# EAGLE design card_template (EAGLE 9.6.2)
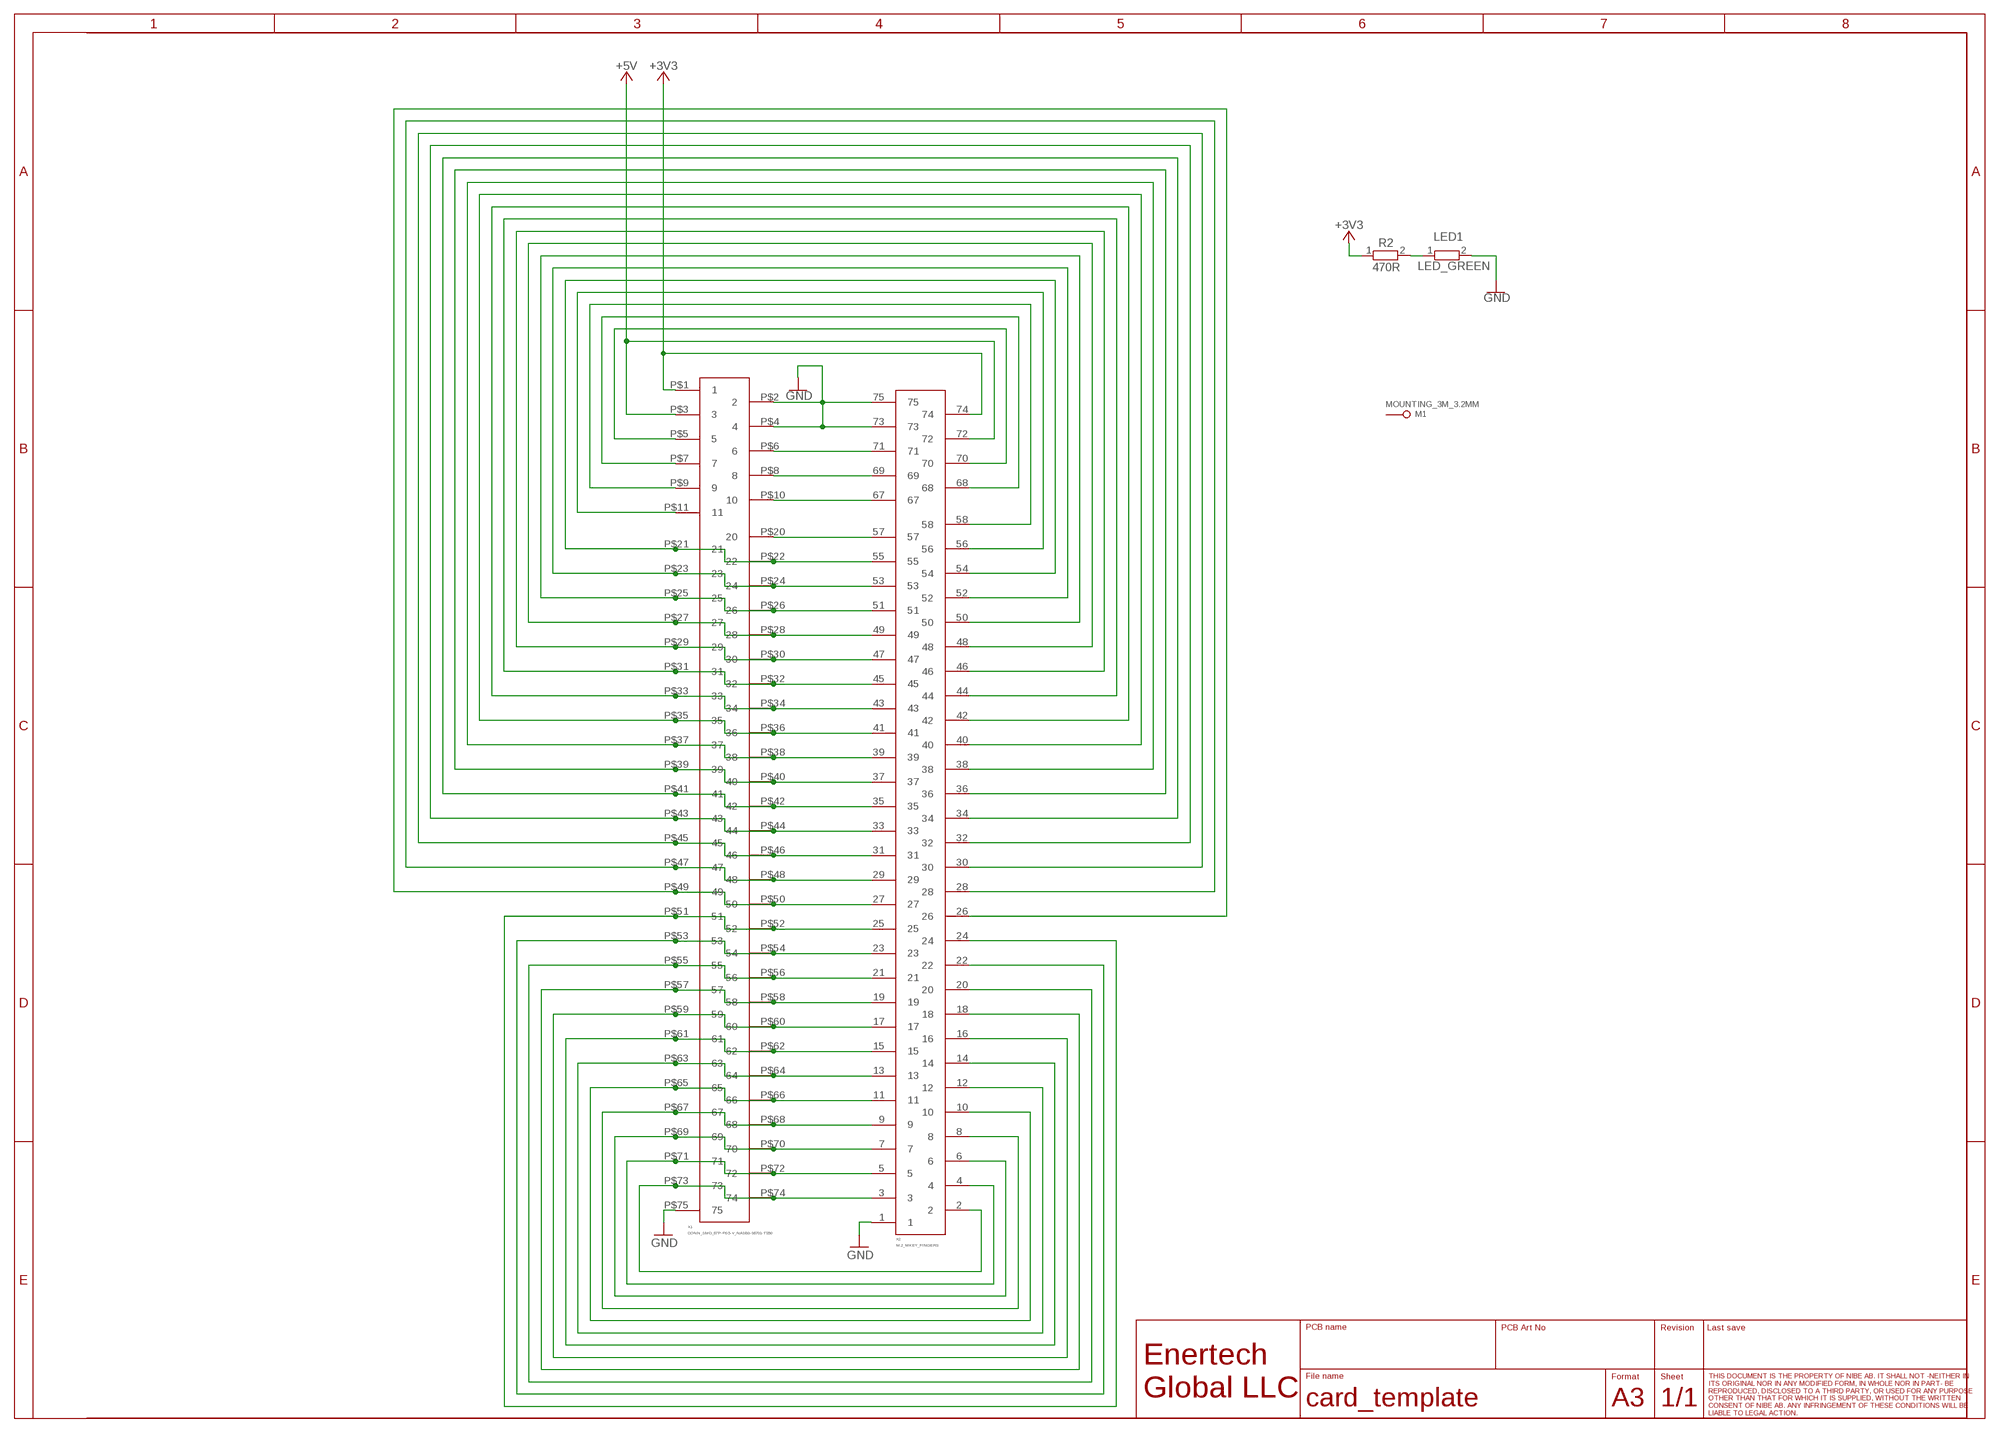
[diagram p0: schematic, sheet 1]

## Parts
LED1  LED_GREEN  R-EU_R0603  [R0603]
M1  MOUNTING_3M_3.2MM  [MOUNTING_3M_3.2MM]
R2  470R  R-EU_R0603  [R0603]
X1  CONN_SMD_67P-P0.5-V_NASB0-S6701-TS50  [CONN_SMD_67P-P0.5-V_NASB0-S6701-TS50]
X2  M.2_MKEY_FINGERS  [M.2_MKEY_FINGERS]

## Nets
+3V3: R2.1 X1.P$1 X2.74
+5V: X1.P$3 X2.72
GND: LED1.2 X1.P$2 X1.P$4 X1.P$75 X2.1 X2.73 X2.75
N$1: X1.P$23 X1.P$24 X2.52 X2.53
N$2: X1.P$25 X1.P$26 X2.50 X2.51
N$3: X1.P$73 X1.P$74 X2.2 X2.3
N$4: X1.P$71 X1.P$72 X2.4 X2.5
N$5: X1.P$69 X1.P$70 X2.6 X2.7
N$6: X1.P$67 X1.P$68 X2.8 X2.9
N$7: X1.P$65 X1.P$66 X2.10 X2.11
N$8: X1.P$63 X1.P$64 X2.12 X2.13
N$9: X1.P$61 X1.P$62 X2.14 X2.15
N$10: X1.P$59 X1.P$60 X2.16 X2.17
N$11: X1.P$57 X1.P$58 X2.18 X2.19
N$12: X1.P$55 X1.P$56 X2.20 X2.21
N$13: X1.P$53 X1.P$54 X2.22 X2.23
N$14: X1.P$51 X1.P$52 X2.24 X2.25
N$15: X1.P$21 X1.P$22 X2.54 X2.55
N$16: X1.P$27 X1.P$28 X2.48 X2.49
N$17: X1.P$29 X1.P$30 X2.46 X2.47
N$18: X1.P$31 X1.P$32 X2.44 X2.45
N$19: X1.P$33 X1.P$34 X2.42 X2.43
N$20: X1.P$35 X1.P$36 X2.40 X2.41
N$21: X1.P$37 X1.P$38 X2.38 X2.39
N$22: X1.P$39 X1.P$40 X2.36 X2.37
N$23: X1.P$41 X1.P$42 X2.34 X2.35
N$24: X1.P$43 X1.P$44 X2.32 X2.33
N$25: X1.P$45 X1.P$46 X2.30 X2.31
N$26: X1.P$47 X1.P$48 X2.28 X2.29
N$27: X1.P$49 X1.P$50 X2.26 X2.27
N$28: X1.P$11 X2.56
N$29: X1.P$9 X2.58
N$30: X1.P$7 X2.68
N$31: X1.P$5 X2.70
N$33: LED1.1 R2.2
N$36: X1.P$6 X2.71
N$37: X1.P$8 X2.69
N$38: X1.P$10 X2.67
N$39: X1.P$20 X2.57
Unconnected: M1.P$1 M1.P$2 M1.P$3

## Library data of the parts
LED1 R2 = _NIBE_rcl:R-EU_: RES THK 1% SMD
M1 = ENERTECH_MISC:MOUNTING_3M_3.2MM
X1 = ENERTECH_MISC:CONN_SMD_67P-P0.5-V_NASB0-S6701-TS50
X2 = ENERTECH_MISC:M.2_MKEY_FINGERS

## Board
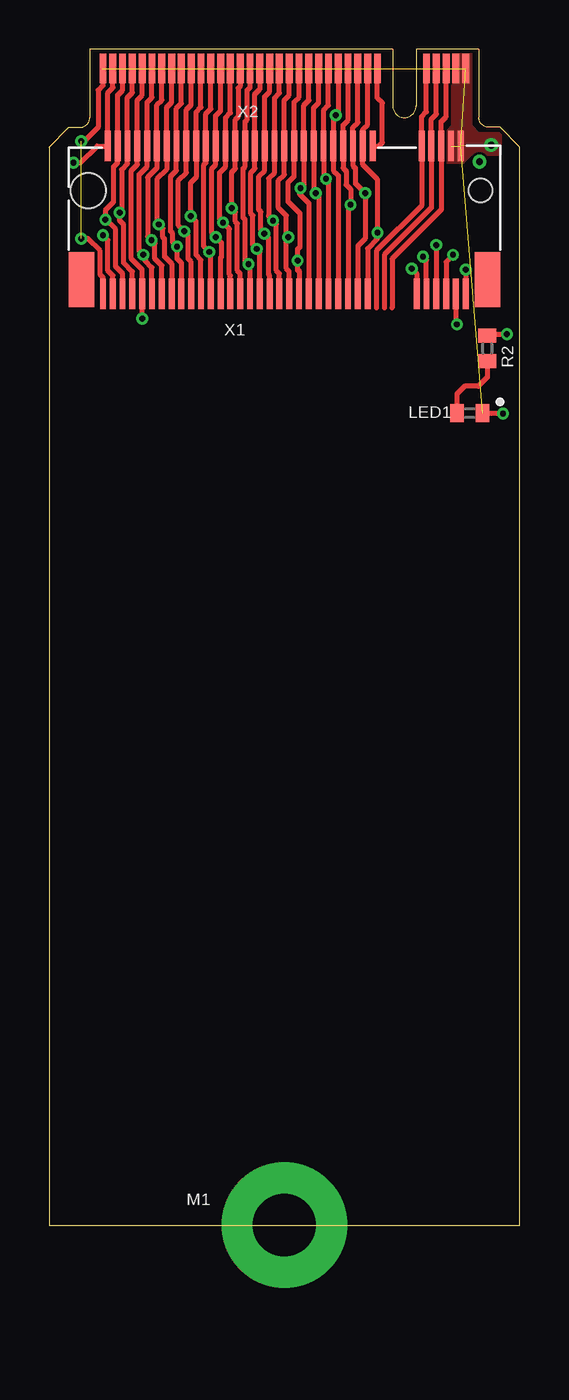
[diagram p1: board, top side]
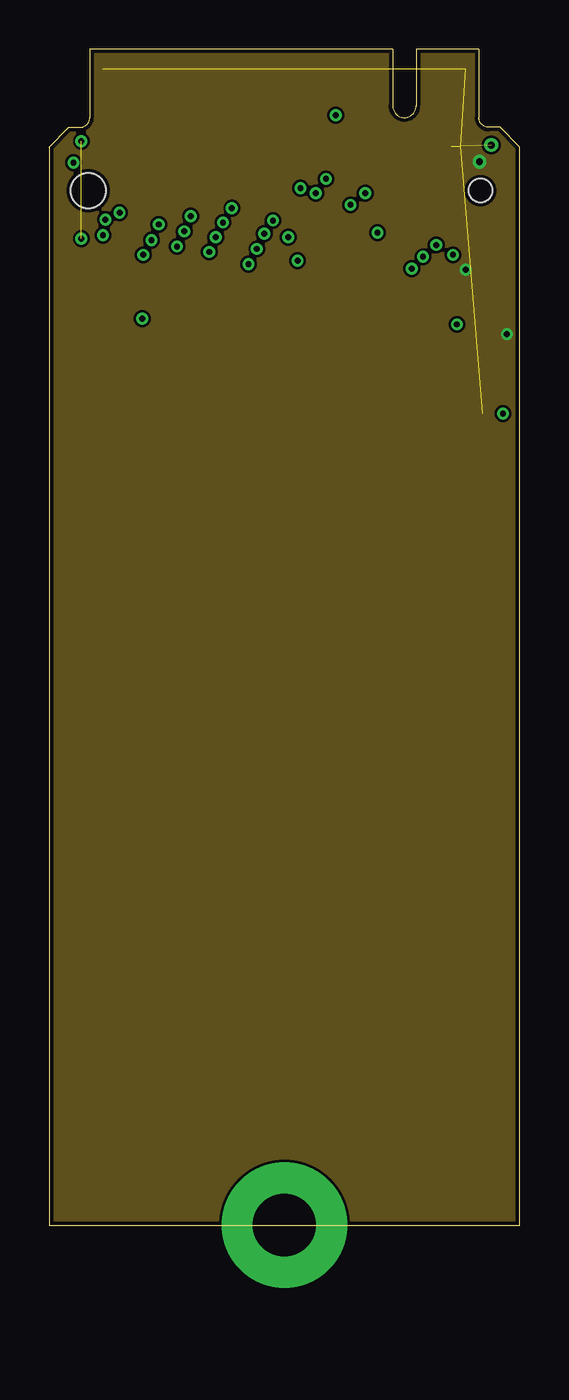
[diagram p2: board, inner layer +3v3]
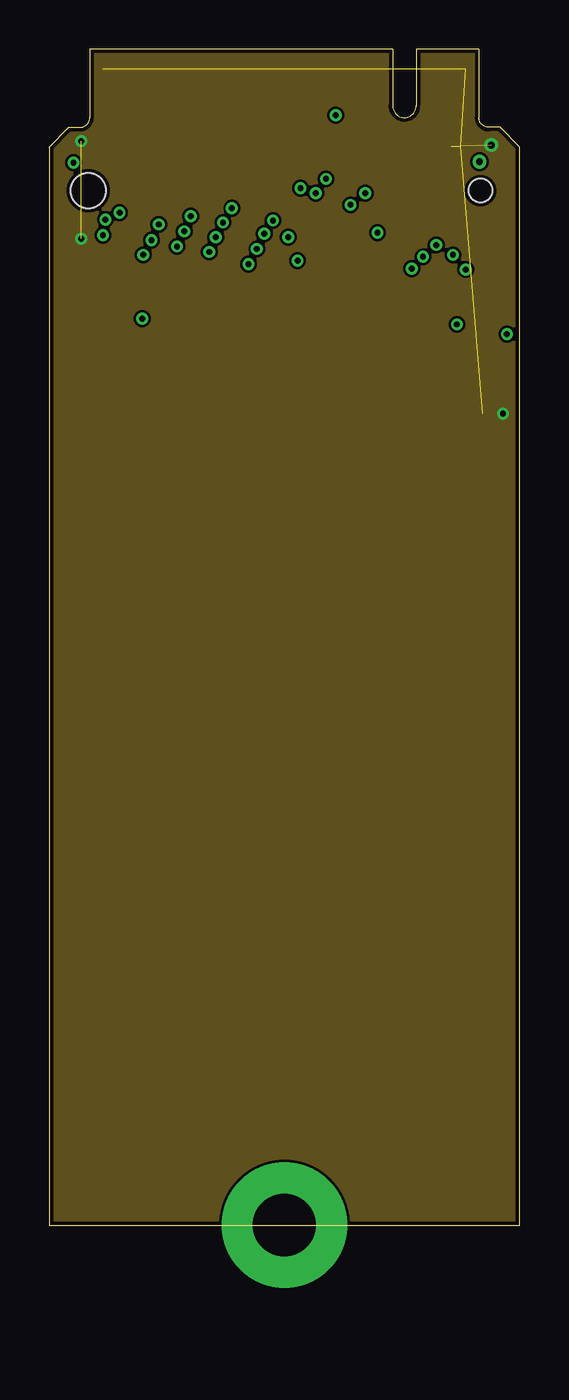
[diagram p3: board, inner layer GND]
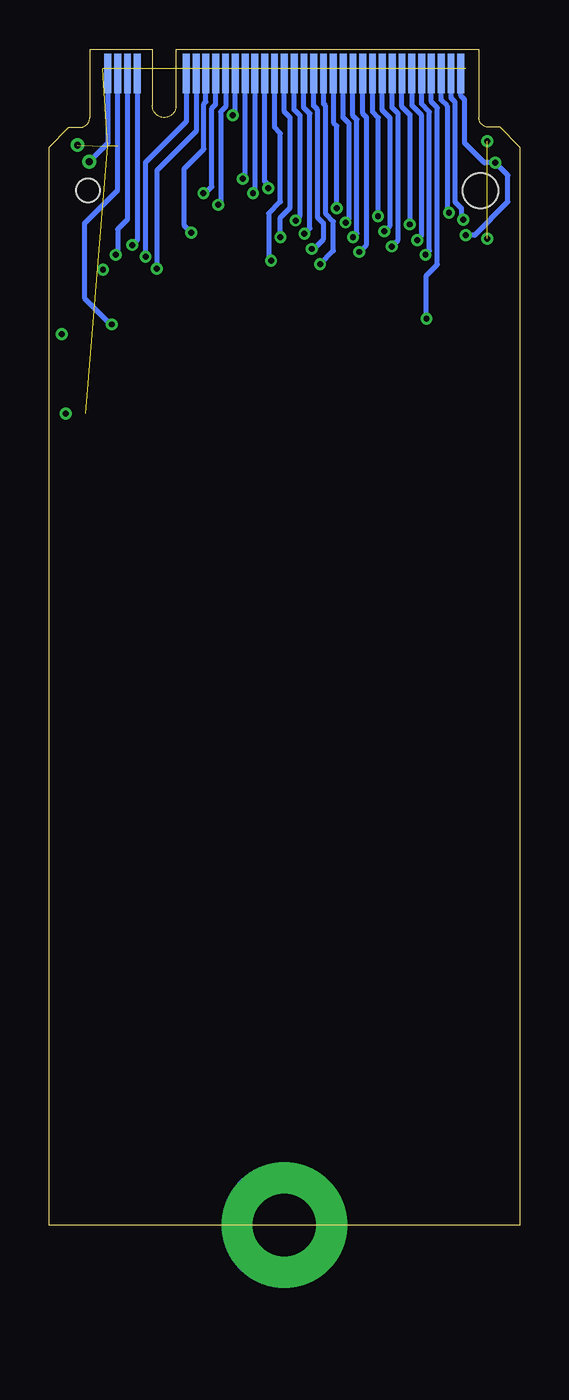
[diagram p4: board, bottom side, seen from below]

Size 24 x 60 mm. Coordinates in mm from the lower left corner, seen from the top.
Outline: 0,0 24,0 24,55 23,56 22.43,56 arc-90 21.93,56.5 21.93,60 18.73,60 18.73,57.1 arc-180 17.52,57.1 17.52,60 2.08,60 2.08,56.5 arc-90 1.57,56 1,56 0,55 0,0
Copper layers (1+2*15+16): Top 0.035mm / dielectric 0.1mm / +3v3 0.035mm / dielectric 1.24mm / GND 0.035mm / dielectric 0.1mm / Bottom 0.035mm
Design rules "enertech_chimera *": minimum track width 10mil, minimum drill 0.3mm, track to track 5mil, track to pad 5mil, pad to pad 5mil, via to via 5mil, smd to smd 0mil, copper to edge 0.2mm, drill to drill 0.5mm, minimum pad ring 0.15mm, minimum via ring 0.15mm, stop-mask expansion 1mil, vias tented up to drill 14mil, thermal gap 4mil

### Footprints (pad centres in the part's own frame; a part is rotated, then mirrored left to right if it is on the bottom)
R0603 = smd 0.7 x 0.9: 1 -0.65,0; 2 0.65,0
MOUNTING_3M_3.2MM = drill 3.2 pad 3.6: P$1 0,0 | smd 6.4 x 6.4: P$2 0,0 | smd 6.4 x 6.4 bottom: P$3 0,0
CONN_SMD_67P-P0.5-V_NASB0-S6701-TS50 = smd 0.3 x 1.55: P$1 -9.25,3.775; P$2 -9,-3.775; P$3 -8.75,3.775; P$4 -8.5,-3.775; P$5 -8.25,3.775; P$6 -8,-3.775; P$7 -7.75,3.775; P$8 -7.5,-3.775; P$9 -7.25,3.775; P$10 -7,-3.775; P$11 -6.75,3.775; P$20 -4.5,-3.775; P$21 -4.25,3.775; P$22 -4,-3.775; P$23 -3.75,3.775; P$24 -3.5,-3.775; P$25 -3.25,3.775; P$26 -3,-3.775; P$27 -2.75,3.775; P$28 -2.5,-3.775; P$29 -2.25,3.775; P$30 -2,-3.775; P$31 -1.75,3.775; P$32 -1.5,-3.775; P$33 -1.25,3.775; P$34 -1,-3.775; P$35 -0.75,3.775; P$36 -0.5,-3.775; P$37 -0.25,3.775; P$38 0,-3.775; P$39 0.25,3.775; P$40 0.5,-3.775; P$41 0.75,3.775; P$42 1,-3.775; P$43 1.25,3.775; P$44 1.5,-3.775; P$45 1.75,3.775; P$46 2,-3.775; P$47 2.25,3.775; P$48 2.5,-3.775; P$49 2.75,3.775; P$50 3,-3.775; P$51 3.25,3.775; P$52 3.5,-3.775; P$53 3.75,3.775; P$54 4,-3.775; P$55 4.25,3.775; P$56 4.5,-3.775; P$57 4.75,3.775; P$58 5,-3.775; P$59 5.25,3.775; P$60 5.5,-3.775; P$61 5.75,3.775; P$62 6,-3.775; P$63 6.25,3.775; P$64 6.5,-3.775; P$65 6.75,3.775; P$66 7,-3.775; P$67 7.25,3.775; P$68 7.5,-3.775; P$69 7.75,3.775; P$70 8,-3.775; P$71 8.25,3.775; P$72 8.5,-3.775; P$73 8.75,3.775; P$74 9,-3.775; P$75 9.25,3.775 | smd 1.3 x 2.8: P$76 10.35,3.05; P$77 -10.35,3.05 | hole 1.2: -10,-1.5 | hole 1.8: 10,-1.5
M.2_MKEY_FINGERS = smd 0.35 x 1.5: 1 -9.25,-1; 3 -8.75,-1; 5 -8.25,-1; 7 -7.75,-1; 9 -7.25,-1; 11 -6.75,-1; 13 -6.25,-1; 15 -5.75,-1; 17 -5.25,-1; 19 -4.75,-1; 21 -4.25,-1; 23 -3.75,-1; 25 -3.25,-1; 27 -2.75,-1; 29 -2.25,-1; 31 -1.75,-1; 33 -1.25,-1; 35 -0.75,-1; 37 -0.25,-1; 39 0.25,-1; 41 0.75,-1; 43 1.25,-1; 45 1.75,-1; 47 2.25,-1; 49 2.75,-1; 51 3.25,-1; 53 3.75,-1; 55 4.25,-1; 57 4.75,-1; 67 7.25,-1; 69 7.75,-1; 71 8.25,-1; 73 8.75,-1; 75 9.25,-1 | smd 0.35 x 2 bottom: 2 -9,-1.25; 4 -8.5,-1.25; 6 -8,-1.25; 8 -7.5,-1.25; 10 -7,-1.25; 12 -6.5,-1.25; 14 -6,-1.25; 16 -5.5,-1.25; 18 -5,-1.25; 20 -4.5,-1.25; 22 -4,-1.25; 24 -3.5,-1.25; 26 -3,-1.25; 28 -2.5,-1.25; 30 -2,-1.25; 32 -1.5,-1.25; 34 -1,-1.25; 36 -0.5,-1.25; 38 0,-1.25; 40 0.5,-1.25; 42 1,-1.25; 44 1.5,-1.25; 46 2,-1.25; 48 2.5,-1.25; 50 3,-1.25; 52 3.5,-1.25; 54 4,-1.25; 56 4.5,-1.25; 58 5,-1.25; 68 7.5,-1.25; 70 8,-1.25; 72 8.5,-1.25; 74 9,-1.25

### Placement (x,y rotation side)
LED1  21.45,41.42 0 top
M1  12,0 0 top
R2  22.35,44.73 270 top
X1  12,51.27 180 top
X2  12,60 0 top

### Tracks (layer width: path | path; a pad name or v marks a point on that pad's centre or on a via)
+3V3  (via drill 0.3, 0.35)
  Top 0.254: v21.25,48.75 X1.P$1 | R2.1 22.43,45.45 v23.35,45.45
  Bottom 0.254: X2.74 21,55.2 v21.95,54.25
  pour +3v3 (no thermals): -1,0 -1,61 25,61 25,-1 -1,-1
+5V  (via drill 0.3)
  Top 0.254: X1.P$3 20.75,46 v20.8,45.95
  Bottom 0.254: v20.8,45.95 20.85,45.95 22.2,47.3 22.2,51.1 20.5,52.8 X2.72
GND  (via drill 0.3, 0.35)  (7 unrouted)
  Top 0.254: v23.15,41.4 22.12,41.4 LED1.2 | X2.1 2.75,58.15 2.5,57.9 2.5,56 1.8,55.3 v1.65,55.3 | X1.P$75 2.75,48.35 2.6,48.5 2.6,49.7 1.98,50.33 v1.65,50.33
  other vias: 22.55,55.1
  pour GND (no thermals): -1,-1 -1,61 25,61 25,-1
  pour Top (no thermals): 20.3,54.2 20.3,55.8 20.6,56.1 20.6,59.8 21.5,59.8 21.5,56.1 21.9,55.7 23,55.7 23,54.6 21.5,54.6 21.1,54.2
N$1  (via drill 0.3)
  Top 0.254: X2.53 15.75,56.25 15.5,56 X1.P$24 15.5,54.05 15.62,53.92 15.62,53.15 v16.12,52.65 16.12,50.33 15.75,49.95 X1.P$23
  Bottom 0.254: X2.52 15.5,57.17 15.7,56.98 15.7,52.98 16.02,52.65 v16.12,52.65
N$2  (via drill 0.3)
  Top 0.254: X2.51 15.25,56.38 15,56.12 X1.P$26 15,53.92 15.15,53.77 15.15,53.08 15.38,52.85 v15.38,52.05 15.25,51.92 X1.P$25
  Bottom 0.254: X2.50 15,57.05 15.25,56.8 15.25,52.17 v15.38,52.05
N$3  (via drill 0.3)
  Top 0.254: X2.3 3.25,58.02 3,57.77 X1.P$74 2.45,55.05 1.6,54.2 v1.25,54.2 | v2.75,50.5 | X1.P$73 3.25,48.45 3,48.7 3,50.25 v2.75,50.5
  Bottom 0.254: v2.75,50.5 2.3,50.5 0.6,52.2 0.6,53.55 v1.25,54.2 1.8,54.2 2.8,55.2 2.8,57.42 3,57.62 X2.2
N$4  (via drill 0.3)
  Top 0.254: X2.5 3.75,57.9 3.5,57.65 X1.P$72 3.5,54.2 3.3,54 3.3,52.2 2.88,51.77 v2.88,51.3 2.9,51.3 3.4,50.8 3.4,48.9 3.75,48.55 X1.P$71
  Bottom 0.254: v2.88,51.3 2.98,51.4 2.98,51.88 3.3,52.2 3.3,57.3 3.5,57.5 X2.4
N$5  (via drill 0.3)
  Top 0.254: X2.7 4.25,57.77 4,57.52 X1.P$70 4,54.15 3.7,53.85 3.7,51.75 v3.6,51.65 3.6,51.25 3.8,51.05 3.8,49.1 4.25,48.65 X1.P$69
  Bottom 0.254: v3.6,51.65 3.7,51.75 3.7,57.1 4,57.4 X2.6
N$6  (via drill 0.3)
  Top 0.254: X2.9 4.75,57.65 4.5,57.4 X1.P$68 4.5,54.1 4.2,53.8 4.2,49.3 4.75,48.75 X1.P$67 v4.75,46.25
  Bottom 0.254: v4.75,46.25 4.75,48.45 4.2,49 4.2,57 4.5,57.3 X2.8
N$7  (via drill 0.3 pad 0.6)
  Top 0.254: X2.11 5.25,57.52 5,57.27 X1.P$66 5,54 4.6,53.6 4.6,49.7 v4.8,49.5 4.9,49.4 4.9,49.2 5.25,48.85 X1.P$65
  Bottom 0.254: v4.8,49.5 4.6,49.7 4.6,56.8 5,57.2 X2.10
N$8  (via drill 0.3)
  Top 0.254: X2.13 5.75,57.4 5.5,57.15 X1.P$64 5.5,53.92 5.03,53.45 5.03,50.45 v5.22,50.25 5.4,50.08 5.4,49.3 5.75,48.95 X1.P$63
  Bottom 0.254: X2.12 5.5,57.12 5.03,56.65 5.03,50.45 v5.22,50.25
N$9  (via drill 0.3)
  Top 0.254: X2.15 6.25,57.27 6,57.02 X1.P$62 6,53.85 5.5,53.35 5.5,51.15 v5.6,51.05 5.8,50.85 5.8,50.4 5.9,50.3 5.9,49.4 6.25,49.05 X1.P$61
  Bottom 0.254: v5.6,51.05 5.6,56.65 6,57.05 X2.14
N$10  (via drill 0.3)
  Top 0.254: X2.17 6.75,57.23 6.5,56.98 X1.P$60 6.5,53.8 6.2,53.5 6.2,50.7 6.3,50.6 6.3,50.15 v6.53,49.92 6.53,49.33 6.75,49.1 X1.P$59
  Bottom 0.254: v6.53,49.92 6.2,50.25 6.2,56.7 6.5,57 X2.16
N$11  (via drill 0.3 pad 0.6)
  Top 0.254: X2.19 7.25,57.15 7,56.9 X1.P$58 7,53.7 6.6,53.3 6.6,51 v6.9,50.7 7.1,50.5 7.1,49.3 7.25,49.15 X1.P$57
  Bottom 0.254: X2.18 7,56.88 6.6,56.48 6.6,51 v6.9,50.7
N$12  (via drill 0.3)
  Top 0.254: X2.21 7.75,57.02 7.5,56.77 X1.P$56 7.5,53.45 7.22,53.17 v7.22,51.48 7.5,51.2 7.5,49.5 7.75,49.25 X1.P$55
  Bottom 0.254: X2.20 7.5,56.8 7.2,56.5 7.2,51.5 v7.22,51.48
N$13  (via drill 0.3)
  Top 0.254: X2.23 8.25,56.95 8,56.7 X1.P$54 8,54.2 7.9,54.1 7.9,49.92 v8.18,49.65 8.25,49.58 X1.P$53
  Bottom 0.254: v8.18,49.65 7.8,50.02 7.8,56.5 8,56.7 X2.22
N$14  (via drill 0.3 pad 0.6)
  Top 0.254: X2.25 8.75,56.85 8.5,56.6 X1.P$52 8.5,54.1 8.3,53.9 8.3,50.6 v8.5,50.4 8.8,50.1 8.8,49.4 8.75,49.35 X1.P$51
  Bottom 0.254: v8.5,50.4 8.3,50.6 8.3,56.4 8.5,56.6 X2.24
N$15  (via drill 0.3)
  Top 0.254: X1.P$21 16.25,49.83 16.75,50.33 v16.75,50.62 16.75,53.35 16,54.1 X1.P$22 16,55.9 16.25,56.15 X2.55
  Bottom 0.254: X2.54 16,57.3 16.1,57.2 16.1,54.9 17.1,53.9 17.1,50.98 v16.75,50.62
N$16  (via drill 0.3)
  Top 0.254: X1.P$27 14.75,53.55 14.5,53.8 X1.P$28 14.5,56.5 v14.62,56.62 14.75,56.75 X2.49
  Bottom 0.254: X2.48 14.5,56.62 v14.62,56.62
N$17  (via drill 0.3)
  Top 0.254: X2.47 14.25,57.12 14,56.88 X1.P$30 14,53.5 v14.12,53.38 14.25,53.25 X1.P$29
  Bottom 0.254: X2.46 14,53.38 v14.12,53.38
N$18  (via drill 0.3)
  Top 0.254: X2.45 13.75,57.25 13.5,57 X1.P$32 13.5,52.75 v13.6,52.65 13.75,52.5 X1.P$31
  Bottom 0.254: X2.44 13.5,52.75 v13.6,52.65
N$19  (via drill 0.3)
  Top 0.254: X2.43 13.25,57.38 13,57.12 X1.P$34 13,53.08 v12.82,52.9 12.78,52.85 12.78,52.6 13.25,52.12 X1.P$33
  Bottom 0.254: X2.42 13,53.25 12.82,53.08 v12.82,52.9
N$20  (via drill 0.3)
  Top 0.254: X1.P$35 12.75,48.7 12.68,48.7 v12.68,49.2 12.68,49.8 12.8,49.92 12.8,51.6 12.2,52.2 12.2,53.2 12.5,53.5 X1.P$36 12.5,57.3 12.75,57.55 X2.41
  Bottom 0.254: v12.68,49.2 12.8,49.33 12.8,51.6 12.2,52.2 12.2,55.7 12.5,56 X2.40
N$21  (via drill 0.3 pad 0.6)
  Top 0.254: X1.P$37 12.25,48.65 12.1,48.8 12.1,50.3 v12.2,50.4 12.1,50.5 12.1,51.5 11.7,51.9 11.7,53.3 12,53.6 X1.P$38 12,57.4 12.25,57.65 X2.39
  Bottom 0.254: v12.2,50.4 12.2,51.4 11.7,51.9 11.7,56.5 12,56.8 X2.38
N$22  (via drill 0.3)
  Top 0.254: X1.P$39 11.75,48.55 11.6,48.7 11.6,51.08 v11.43,51.25 11.2,51.48 11.2,53.4 11.5,53.7 X1.P$40 11.5,57.5 11.75,57.75 X2.37
  Bottom 0.254: v11.43,51.25 11.2,51.48 11.2,56.6 11.5,56.9 X2.36
N$23  (via drill 0.3)
  Top 0.254: X2.35 11.25,57.83 11,57.58 X1.P$42 11,53.8 10.7,53.5 10.7,51.8 10.8,51.7 10.8,50.75 v10.97,50.58 11.2,50.35 11.2,48.5 11.25,48.45 X1.P$41
  Bottom 0.254: v10.97,50.58 10.7,50.85 10.7,56.7 11,57 X2.34
N$24  (via drill 0.3 pad 0.6)
  Top 0.254: X2.33 10.75,57.95 10.5,57.7 X1.P$44 10.5,53.9 10.3,53.7 10.3,51.6 10.4,51.5 10.4,50 v10.6,49.8 10.75,49.65 X1.P$43
  Bottom 0.254: X2.32 10.5,57.1 10.3,56.9 10.3,51.4 10,51.1 10,50.3 10.5,49.8 v10.6,49.8
N$25  (via drill 0.3)
  Top 0.254: X1.P$45 10.25,48.95 v10.18,49.02 10,49.2 10,51.3 9.9,51.4 9.9,53.9 10,54 X1.P$46 10,56.3 10.1,56.4 10.1,57.9 10.25,58.05 X2.31
  Bottom 0.254: v10.18,49.02 9.5,49.7 9.5,51.2 9.9,51.6 9.9,57.1 10,57.2 X2.30
N$26  (via drill 0.3)
  Top 0.254: X2.29 9.75,58.1 9.65,58 9.65,56.55 9.5,56.4 X1.P$48 9.5,53.9 9.32,53.73 v9.32,51.88 9.5,51.7 9.5,51.2 9.6,51.1 9.6,48.7 9.75,48.55 X1.P$47
  Bottom 0.254: v9.32,51.88 9.32,56.08 9.5,56.25 X2.28
N$27  (via drill 0.3)
  Top 0.254: X2.27 9.25,56.75 9,56.5 X1.P$50 9,54 8.7,53.7 8.7,51.33 v8.88,51.15 9.2,50.83 9.2,48.5 9.25,48.45 X1.P$49
  Bottom 0.254: v8.88,51.15 8.7,51.33 8.7,56.2 9,56.5 X2.26
N$28  (via drill 0.3 pad 0.6)
  Top 0.254: v18.5,48.8 18.75,48.55 X1.P$11
  Bottom 0.254: X2.56 16.5,55.8 18.5,53.8 v18.5,48.8
N$29  (via drill 0.3)
  Top 0.254: v19.07,49.4 19.25,49.23 X1.P$9
  Bottom 0.254: X2.58 17,56.3 19.07,54.23 v19.07,49.4
N$30  (via drill 0.3)
  Top 0.254: v19.75,50 X1.P$7
  Bottom 0.254: X2.68 19.5,50.25 v19.75,50
N$31  (via drill 0.3 pad 0.6)
  Top 0.254: v20.6,49.5 20.25,49.15 X1.P$5
  Bottom 0.254: X2.70 20,51.3 20.5,50.8 20.5,49.6 v20.6,49.5
N$33
  Top 0.254: R2.2 22.35,43.25 21.9,42.8 21.2,42.8 20.8,42.4 LED1.1
N$36
  Top 0.254: X2.71 20.25,56.55 20,56.3 X1.P$6 20,51.8 17.5,49.3 17.5,46.8
N$37
  Top 0.254: X2.69 19.75,56.67 19.5,56.42 X1.P$8 19.5,51.9 17.1,49.5 17.1,46.8
N$38
  Top 0.254: X2.67 19.25,56.8 19,56.55 X1.P$10 19,52 16.7,49.7 16.7,46.8
N$39
  Top 0.254: X2.57 16.75,57.5 17,57.25 17,55.23 16.82,55.05 X1.P$20